# Altium project PCB_Project_3.PrjPcb
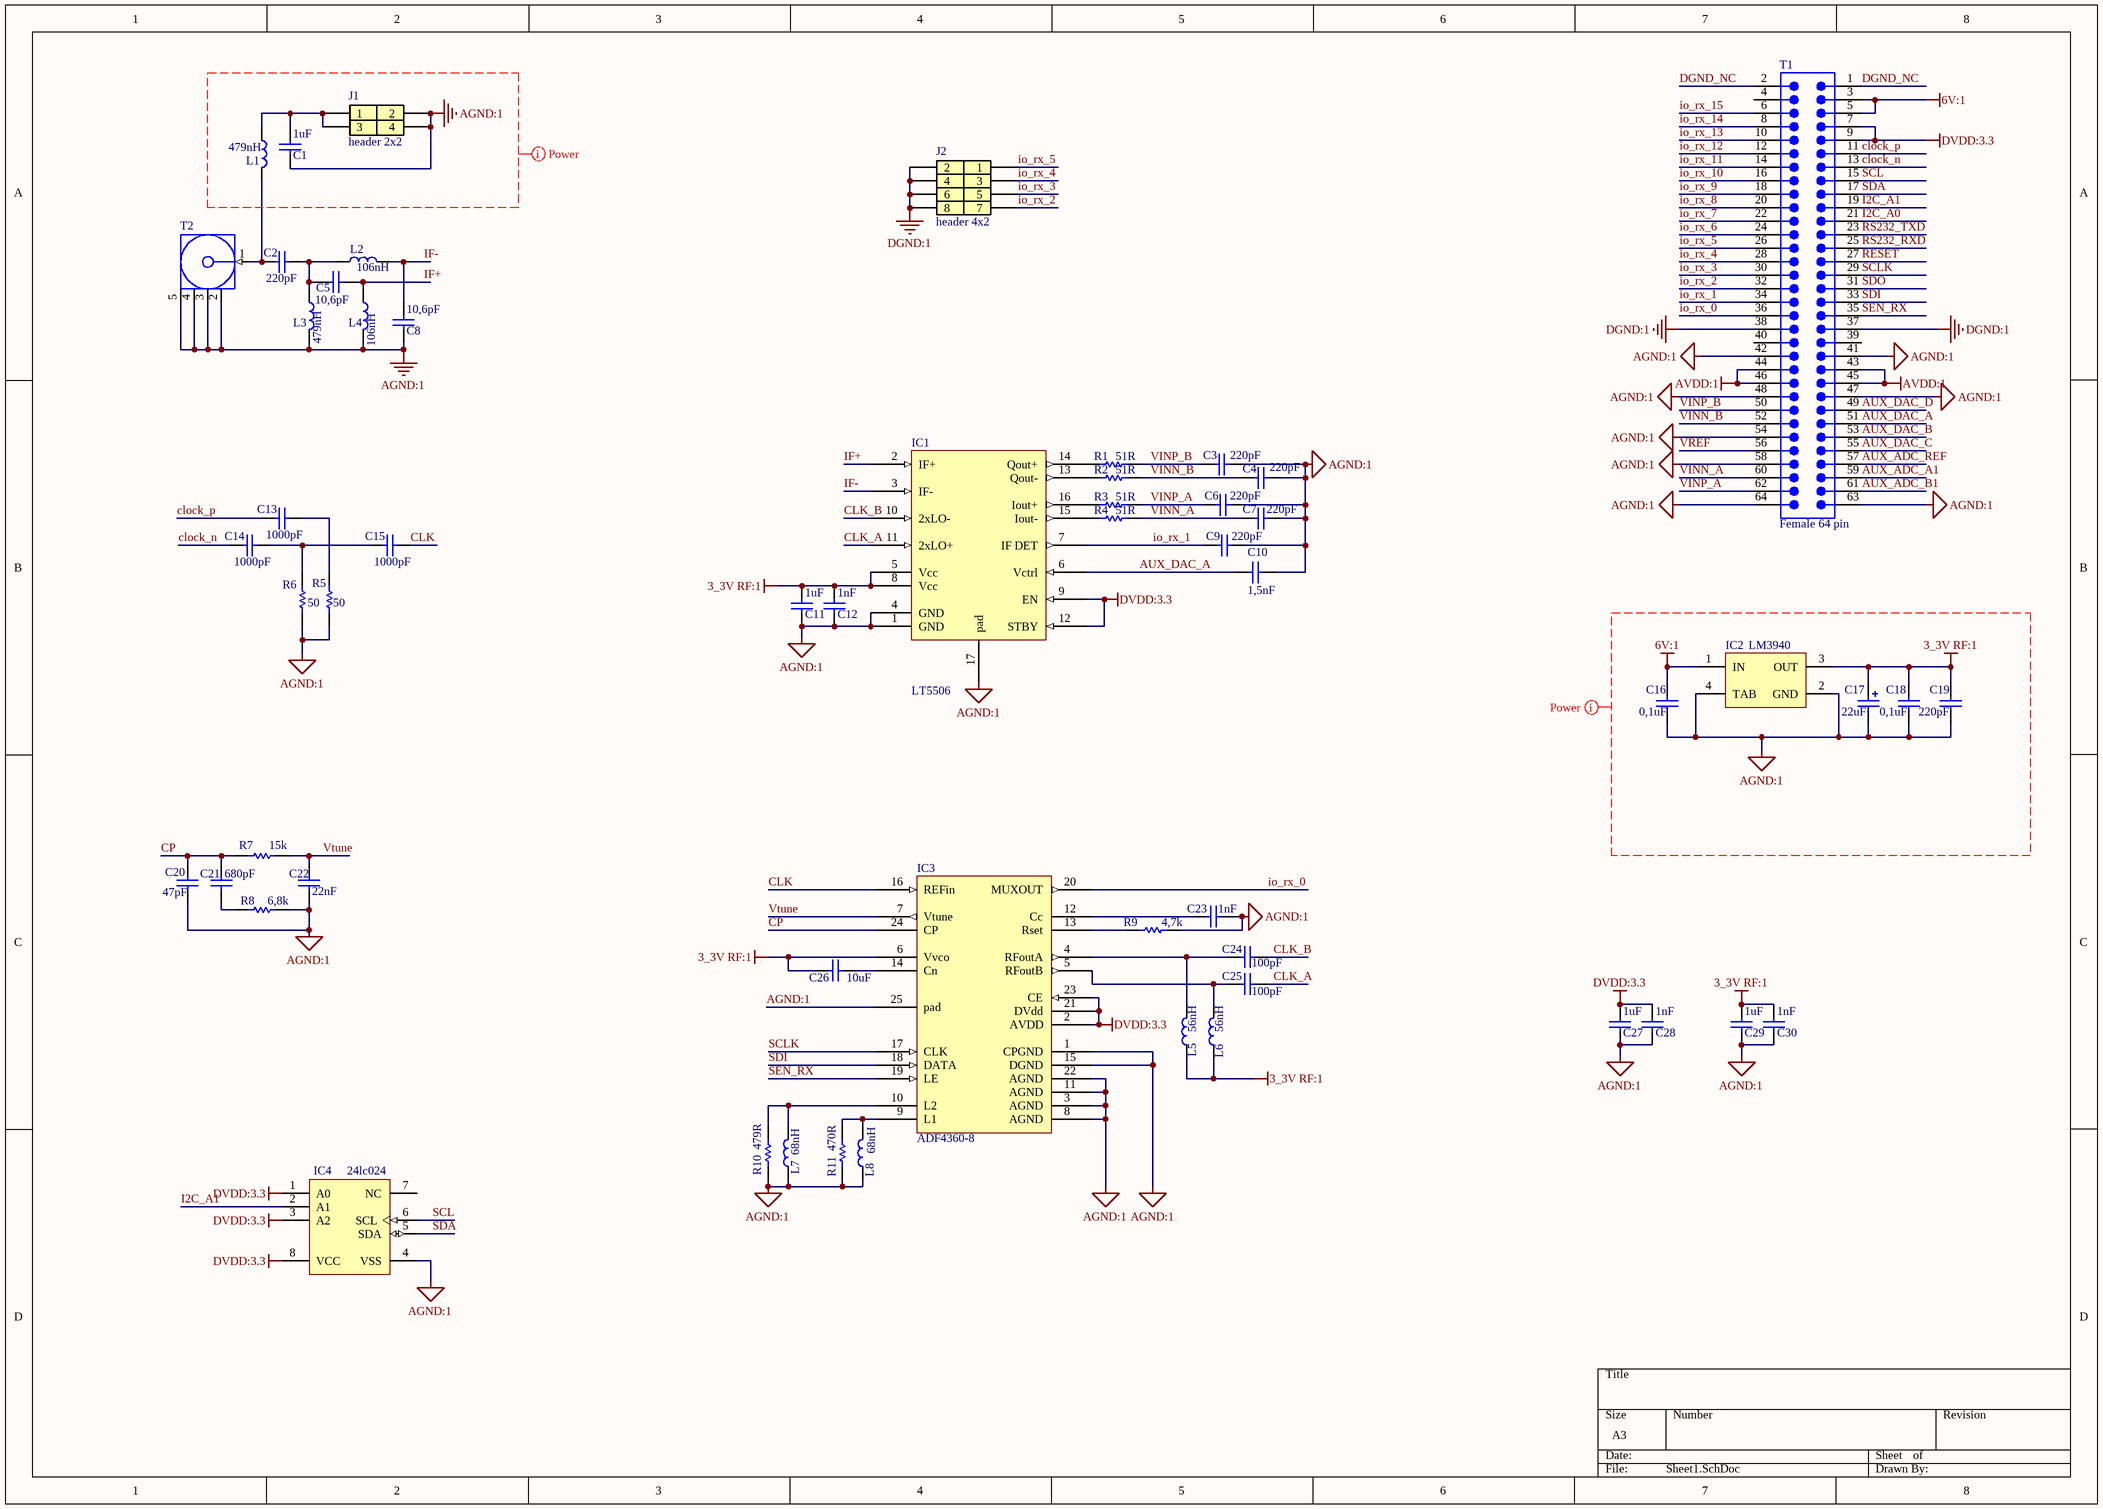
[diagram p0: Sheet1.SchDoc]
1 sheet, 57 parts. Net scope: global (net labels, ports and power ports of the same name join across sheets).
Board file: RX_137.PcbDoc

## Sheet Sheet1.SchDoc
size A3

### Parts
C1  1uF  [0805 cap]
C2  220pF  [0805 cap]
C3  220pF  [0805 cap]
C4  220pF  [0805 cap]
C5  10,6pF  [0805 cap]
C6  220pF  [0805 cap]
C7  220pF  [0805 cap]
C8  10,6pF  [0805 cap]
C9  220pF  [0805 cap]
C10  1,5nF  [0805 cap]
C11  1uF  [0805 cap]
C12  1nF  [0805 cap]
C13  1000pF  [0805 cap]
C14  1000pF  [0805 cap]
C15  1000pF  [0805 cap]
C16  0,1uF  [0805 cap]
C17  22uF  [capacitor C]
C18  0,1uF  [0805 cap]
C19  220pF  [0805 cap]
C20  47pF  [0805 cap]
C21  680pF  [0805 cap]
C22  22nF  [0805 cap]
C23  1nF  [0805 cap]
C24  100pF  [0805 cap]
C25  100pF  [0805 cap]
C26  10uF  [0805 cap]
C27  1uF  [0805 cap]
C28  1nF  [0805 cap]
C29  1uF  [0805 cap]
C30  1nF  [0805 cap]
IC1  LT5506  [QFN65P400X400X80-16N]
IC2  LM3940  [TO-263]
IC3  ADF4360-8  [QFN50P408X408X100-24N]
IC4  24lc024  [SOIC_SN8]
J1  header 2x2  [pld 2x2]
J2  header 4x2  [H_4x2]
L1  479nH  [inductor 0805]
L2  106nH  [inductor 0805]
L3  479nH  [inductor 0805]
L4  106nH  [inductor 0805]
L5  56nH  [inductor 0805]
L6  56nH  [inductor 0805]
L7  68nH  [inductor 0805]
L8  68nH  [inductor 0805]
R1  51R  [0805 resistor]
R2  51R  [0805 resistor]
R3  51R  [0805 resistor]
R4  51R  [0805 resistor]
R5  50  [0805 resistor]
R6  50  [0805 resistor]
R7  15k  [0805 resistor]
R8  6,8k  [0805 resistor]
R9  4,7k  [0805 resistor]
R10  479R  [0805 resistor]
R11  470R  [0805 resistor]
T1  Female 64 pin  [64pin female Mezzanine]
T2  mcx_connect  [mcx_ra]  (value not drawn)

### Nets
3_3V RF:1: C11.2 C12.2 C17.1 C18.2 C19.2 C26.1 C29.2 C30.2 IC1.5(Vcc) IC1.8(Vcc) IC2.3(OUT) IC3.6(Vvco) L5.1 L6.1
6V:1: C16.1 IC2.1(IN) T1.3 T1.5
AGND:1: C1.1 C3.2 C4.2 C6.2 C7.2 C8.1 C9.2 C10.1 C11.1 C12.1 C16.2 C17.2 C18.1 C19.1 C20.1 C22.1 C23.1 C27.1 C28.1 C29.1 C30.1 IC1.1(GND) IC1.4(GND) IC1.17(pad) IC2.2(GND) IC2.4(TAB) IC3.1(CPGND) IC3.3(AGND) IC3.8(AGND) IC3.11(AGND) IC3.15(DGND) IC3.22(AGND) IC3.25(pad) IC4.4(VSS) J1.2 J1.4 L3.2 L4.2 L7.1 L8.1 R5.1 R6.1 R8.2 R9.2 R10.1 R11.1 T1.41 T1.42 T1.47 T1.48 T1.54 T1.58 T1.63 T1.64 T2.2(GND) T2.3(GND) T2.4(GND) T2.5(GND)
AVDD:1: T1.43 T1.44 T1.45 T1.46
DGND:1: J2.2 J2.4 J2.6 J2.8 T1.37 T1.38
DVDD:3.3: C27.2 C28.2 IC1.9(EN) IC1.12(STBY) IC3.2(AVDD) IC3.21(DVdd) IC3.23(CE) IC4.1(A0) IC4.3(A2) IC4.8(VCC) T1.7 T1.9
AUX_ADC_A1: T1.59
AUX_ADC_B1: T1.61
AUX_ADC_REF: T1.57
AUX_DAC_A: C10.2 IC1.6(Vctrl) T1.51
AUX_DAC_B: T1.53
AUX_DAC_C: T1.55
AUX_DAC_D: T1.49
CLK: C15.2 IC3.16(REFin)
CLK_A: C25.1 IC1.11(2xLO+)
CLK_B: C24.1 IC1.10(2xLO-)
clock_n: C14.1 T1.13
clock_p: C13.1 T1.11
CP: C20.2 C21.2 IC3.24(CP) R7.1
DGND_NC: T1.1 T1.2
I2C_A0: T1.21
I2C_A1: IC4.2(A1) T1.19
IF+: C5.2 IC1.2(IF+) L4.1
IF-: C8.2 IC1.3(IF-) L2.2
io_rx_0: IC3.20(MUXOUT) T1.36
io_rx_1: C9.1 IC1.7(IF_DET) T1.34
io_rx_2: J2.7 T1.32
io_rx_3: J2.5 T1.30
io_rx_4: J2.3 T1.28
io_rx_5: J2.1 T1.26
io_rx_6: T1.24
io_rx_7: T1.22
io_rx_8: T1.20
io_rx_9: T1.18
io_rx_10: T1.16
io_rx_11: T1.14
io_rx_12: T1.12
io_rx_13: T1.10
io_rx_14: T1.8
io_rx_15: T1.6
RESET: T1.27
RS232_RXD: T1.25
RS232_TXD: T1.23
SCL: IC4.6(SCL) T1.15
SCLK: IC3.17(CLK) T1.29
SDA: IC4.5(SDA) T1.17
SDI: IC3.18(DATA) T1.33
SDO: T1.31
SEN_RX: IC3.19(LE) T1.35
VINN_A: C7.1 R4.2 T1.60
VINN_B: C4.1 R2.2 T1.52
VINP_A: C6.1 R3.2 T1.62
VINP_B: C3.1 R1.2 T1.50
VREF: T1.56
Vtune: C22.2 IC3.7(Vtune) R7.2
NetC1_2: C1.2 J1.1 J1.3 L1.1
NetC2_1: C2.1 L1.2 T2.1(Signal)
NetC2_2: C2.2 C5.1 L2.1 L3.1
NetC13_2: C13.2 R5.2
NetC14_2: C14.2 C15.1 R6.2
NetC21_1: C21.1 R8.1
NetC23_2: C23.2 IC3.12(Cc)
NetC24_2: C24.2 IC3.4(RFoutA) L5.2
NetC25_2: C25.2 IC3.5(RFoutB) L6.2
NetC26_2: C26.2 IC3.14(Cn)
NetIC1_13: IC1.13(Qout-) R2.1
NetIC1_14: IC1.14(Qout+) R1.1
NetIC1_15: IC1.15(Iout-) R4.1
NetIC1_16: IC1.16(Iout+) R3.1
NetIC3_9: IC3.9(L1) L8.2 R11.2
NetIC3_10: IC3.10(L2) L7.2 R10.2
NetIC3_13: IC3.13(Rset) R9.1

Not connected (* = marked no-connect by the designer): IC4 7(NC); T1 4 39 40

### Layout directives
net class Power: 3_3V RF:1, 6V:1, AGND:1

### Library data of the parts
C1-C16 C18-C30 = ceramic capacitor
C17 = tantalum capacitor
IC1 = LT5506: 40MHz to 500MHz  Quadrature Demodulator  with VGA
IC3 = ADF4360-8: Integrated Synthesizer and VCO
L1-L8 = inductor
  L4: value: 106nH
R1-R11 = resistor